# EAGLE board VOID01_REVA (EAGLE 7.7.0), part 1 of 2
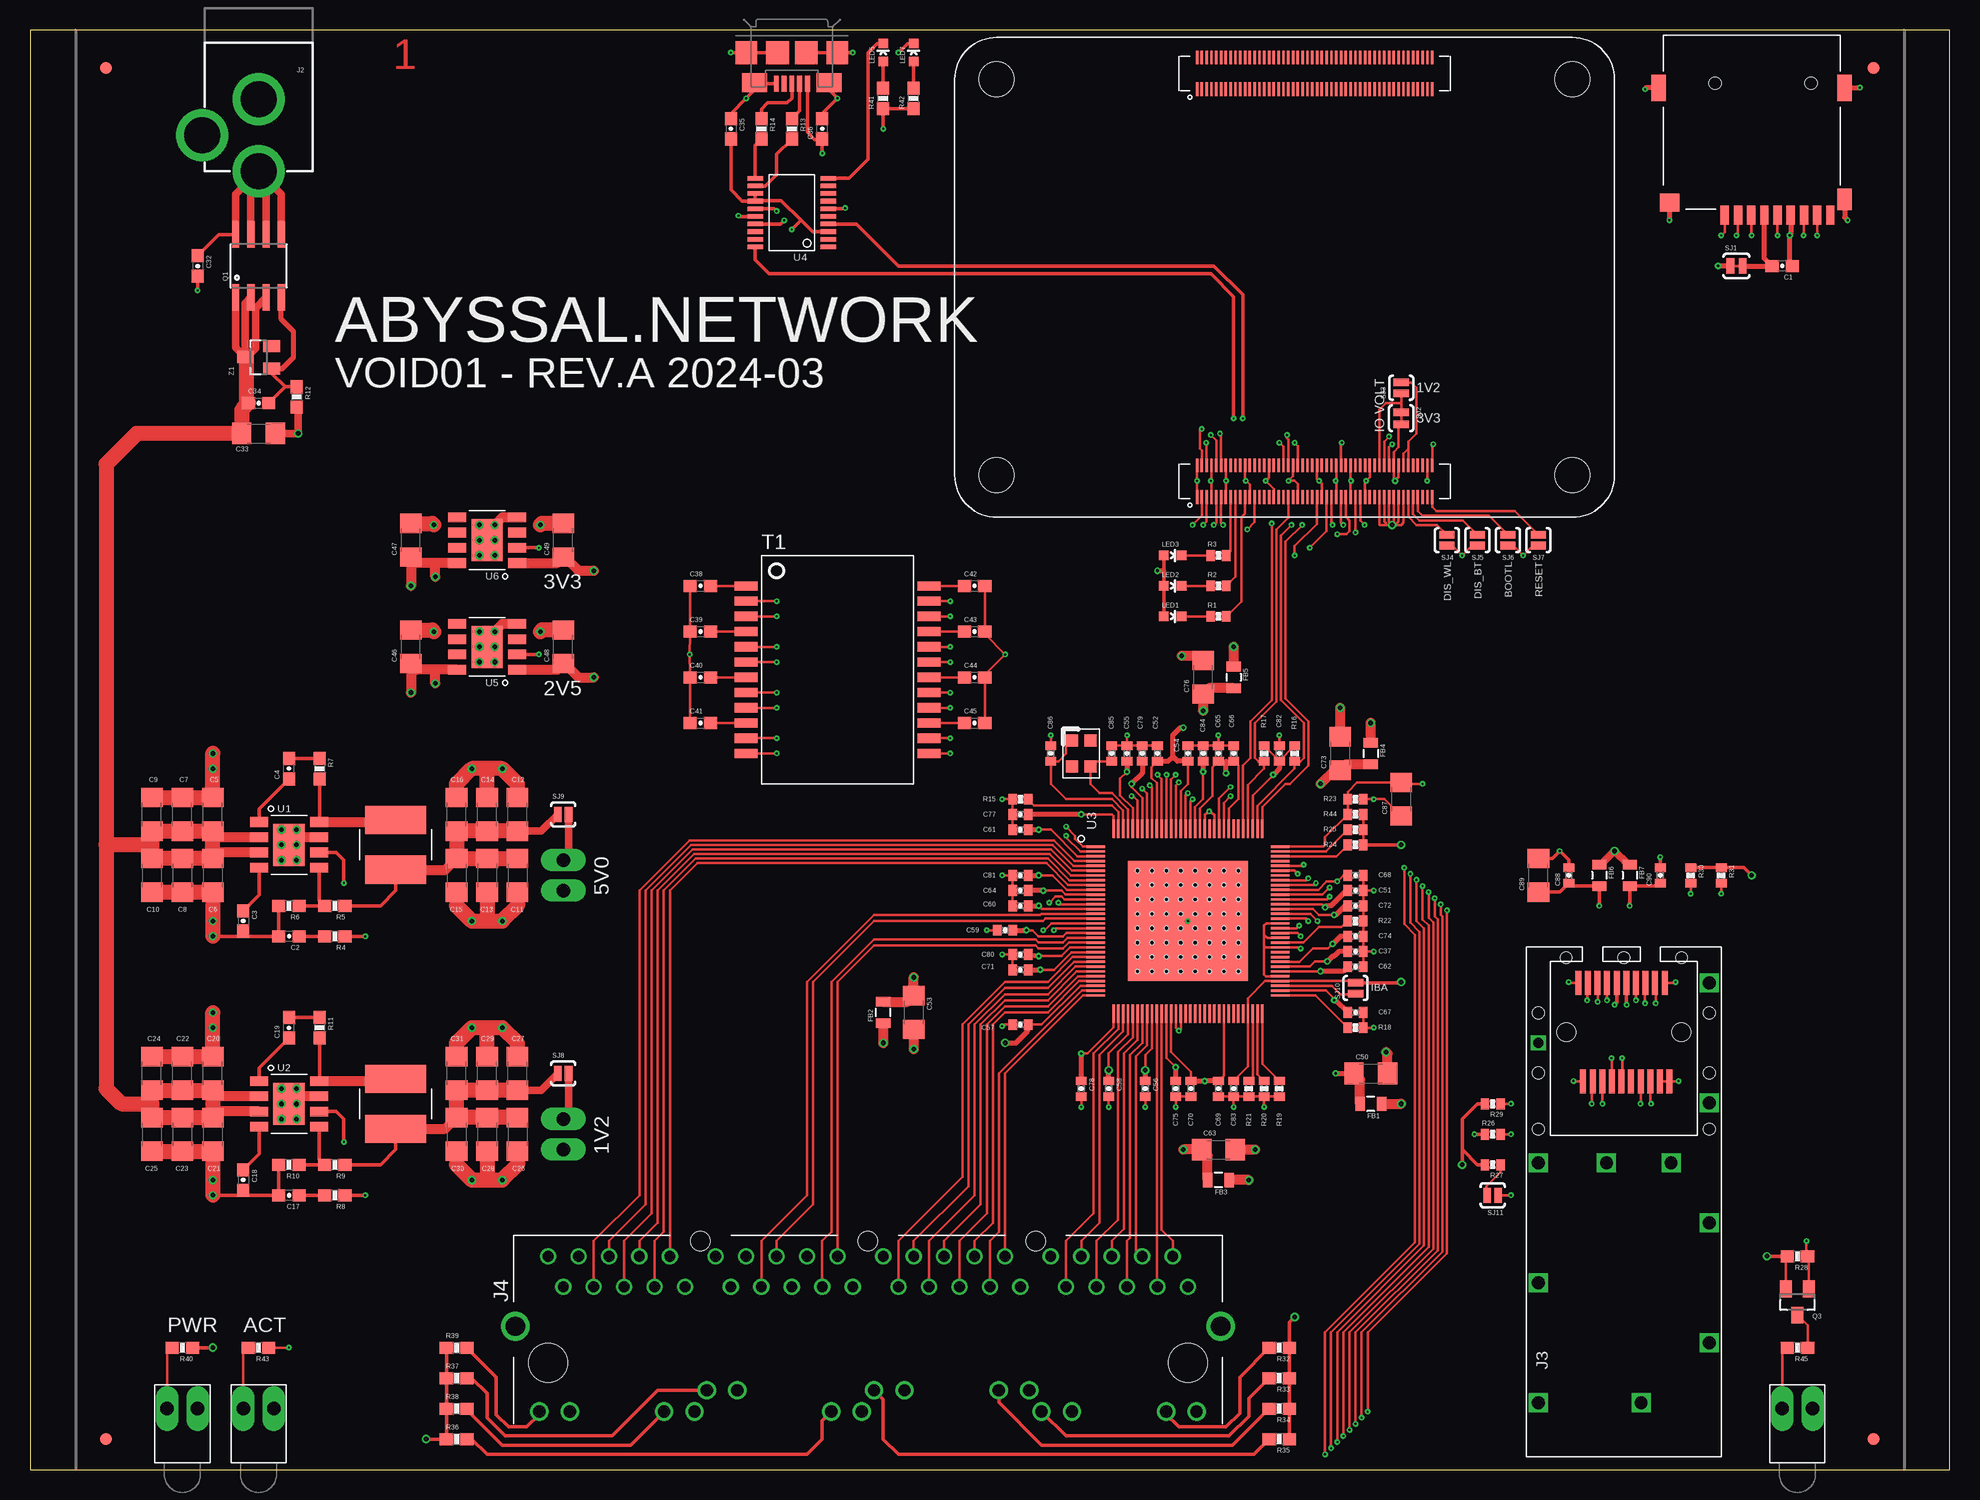
[diagram p6: board, top side]
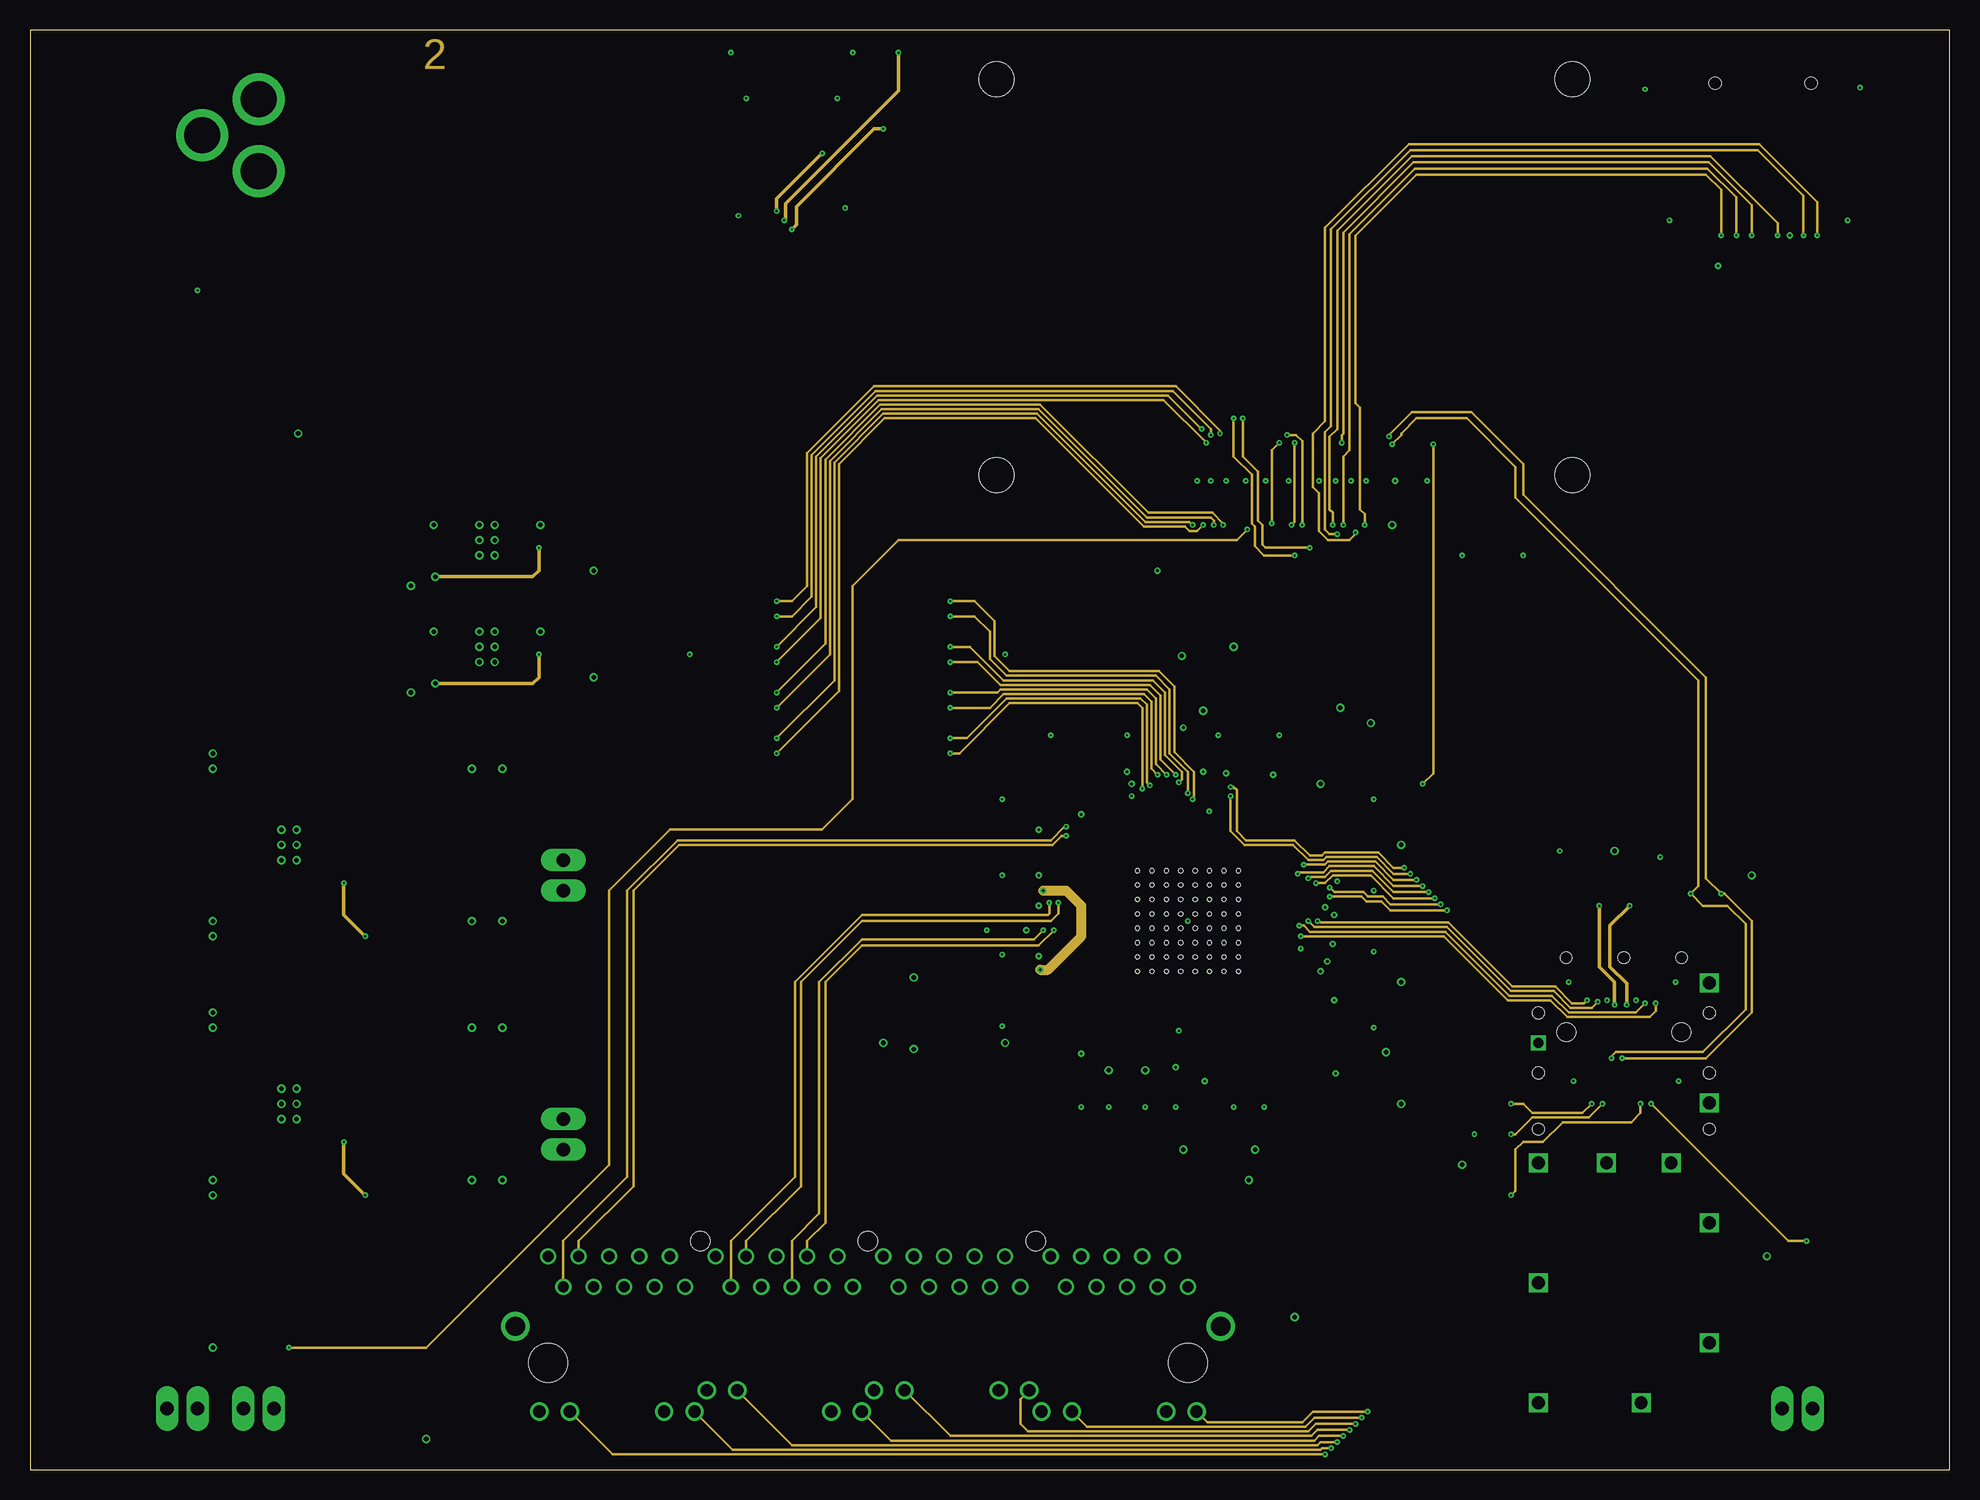
[diagram p7: board, inner layer Route2]
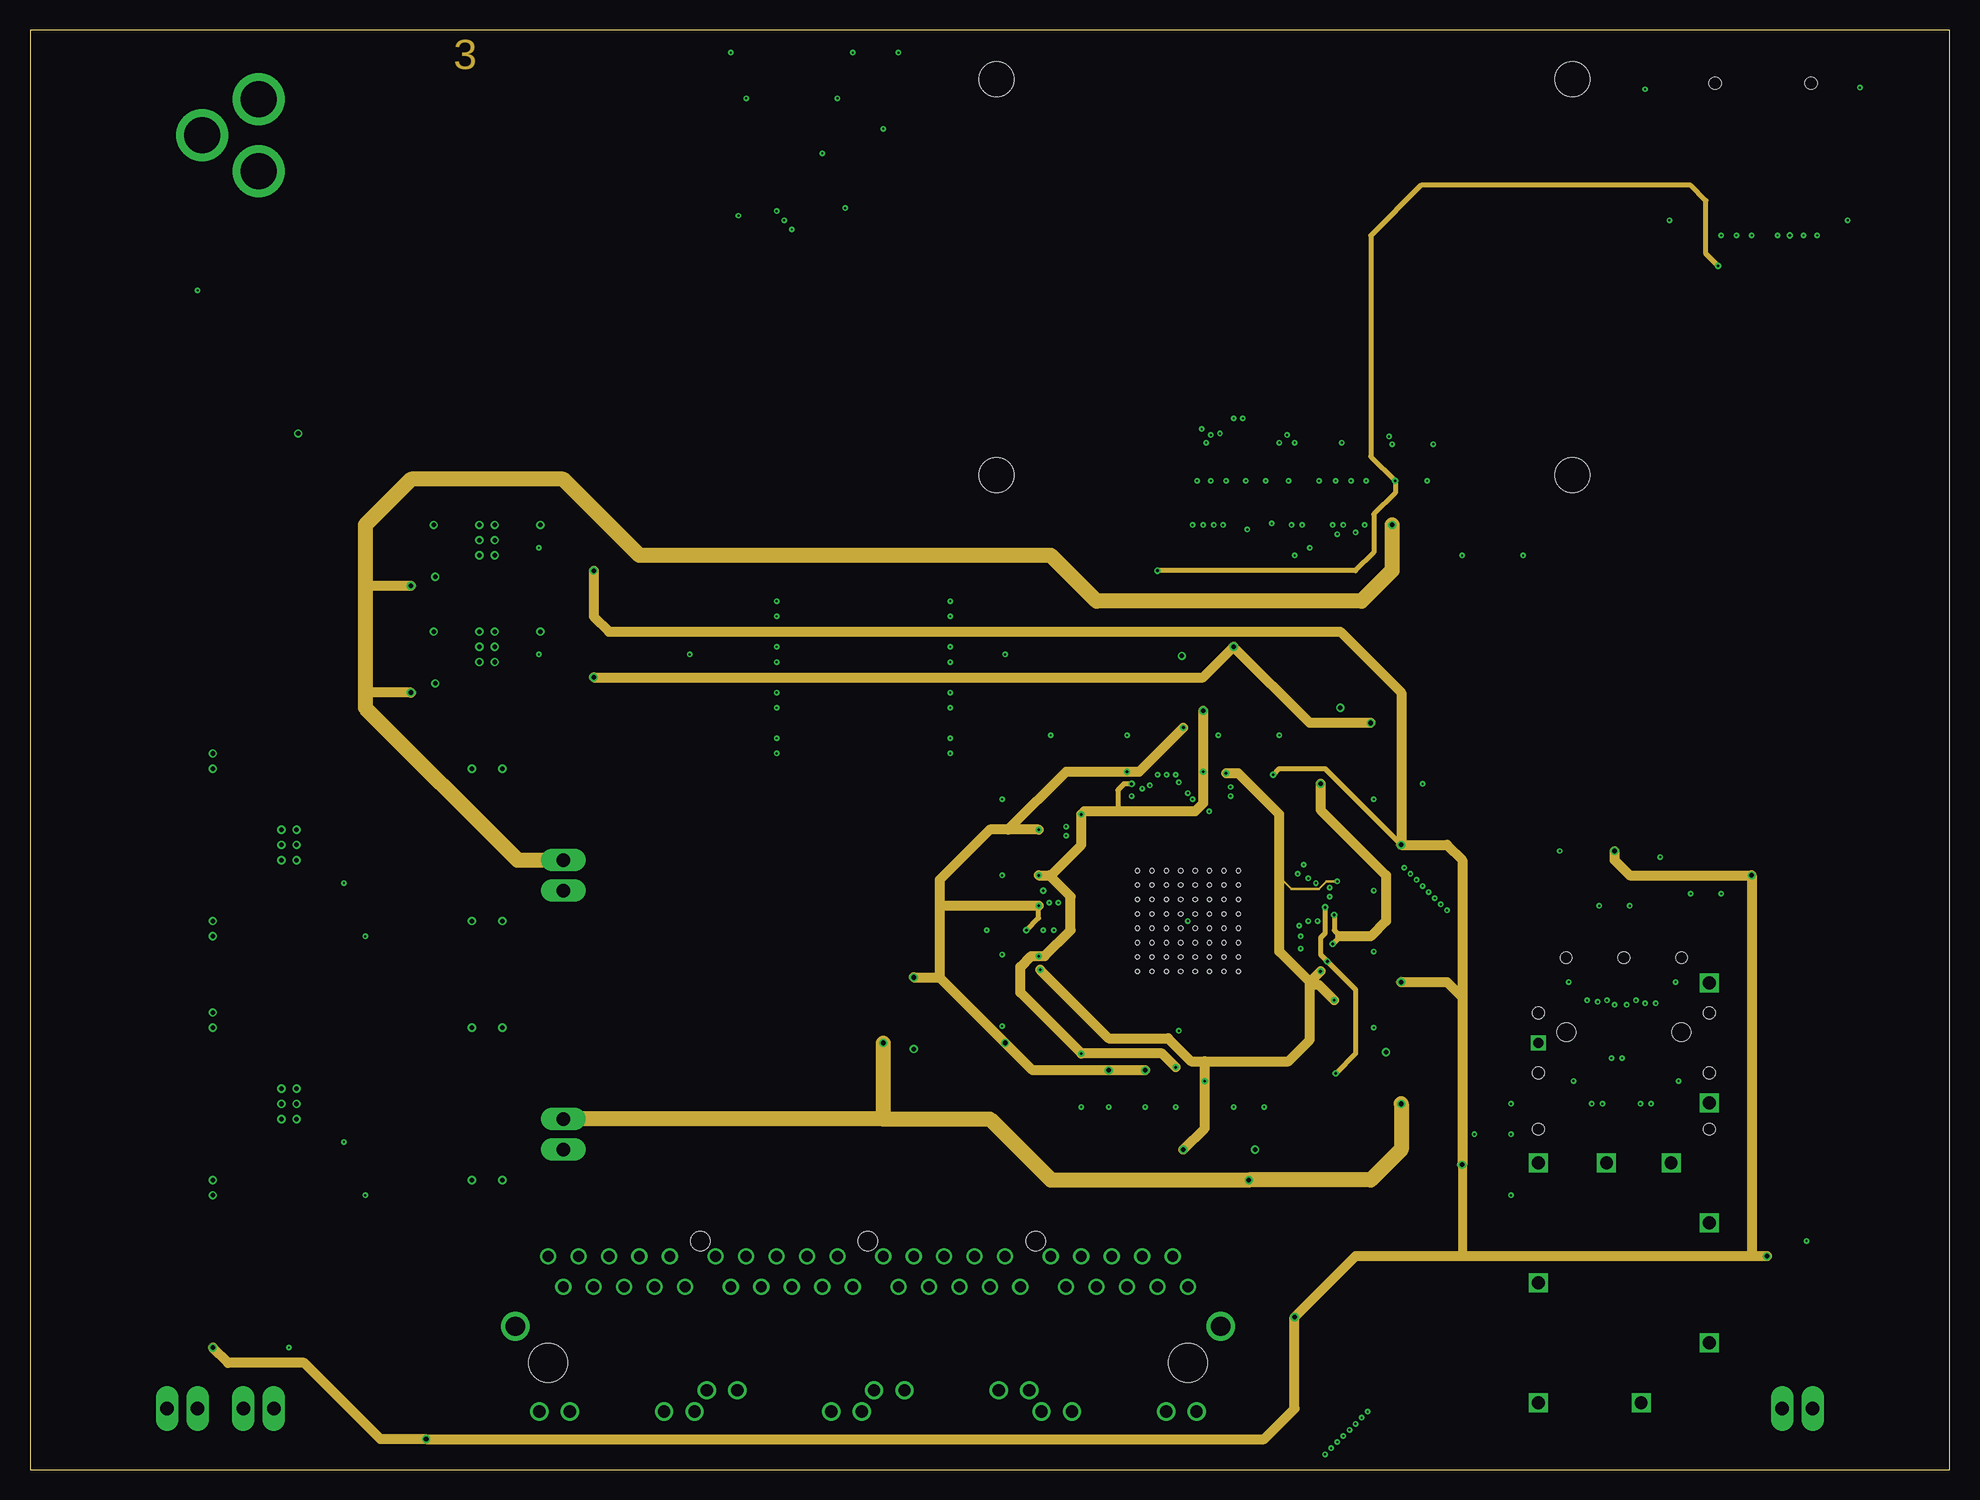
[diagram p8: board, inner layer Route15]
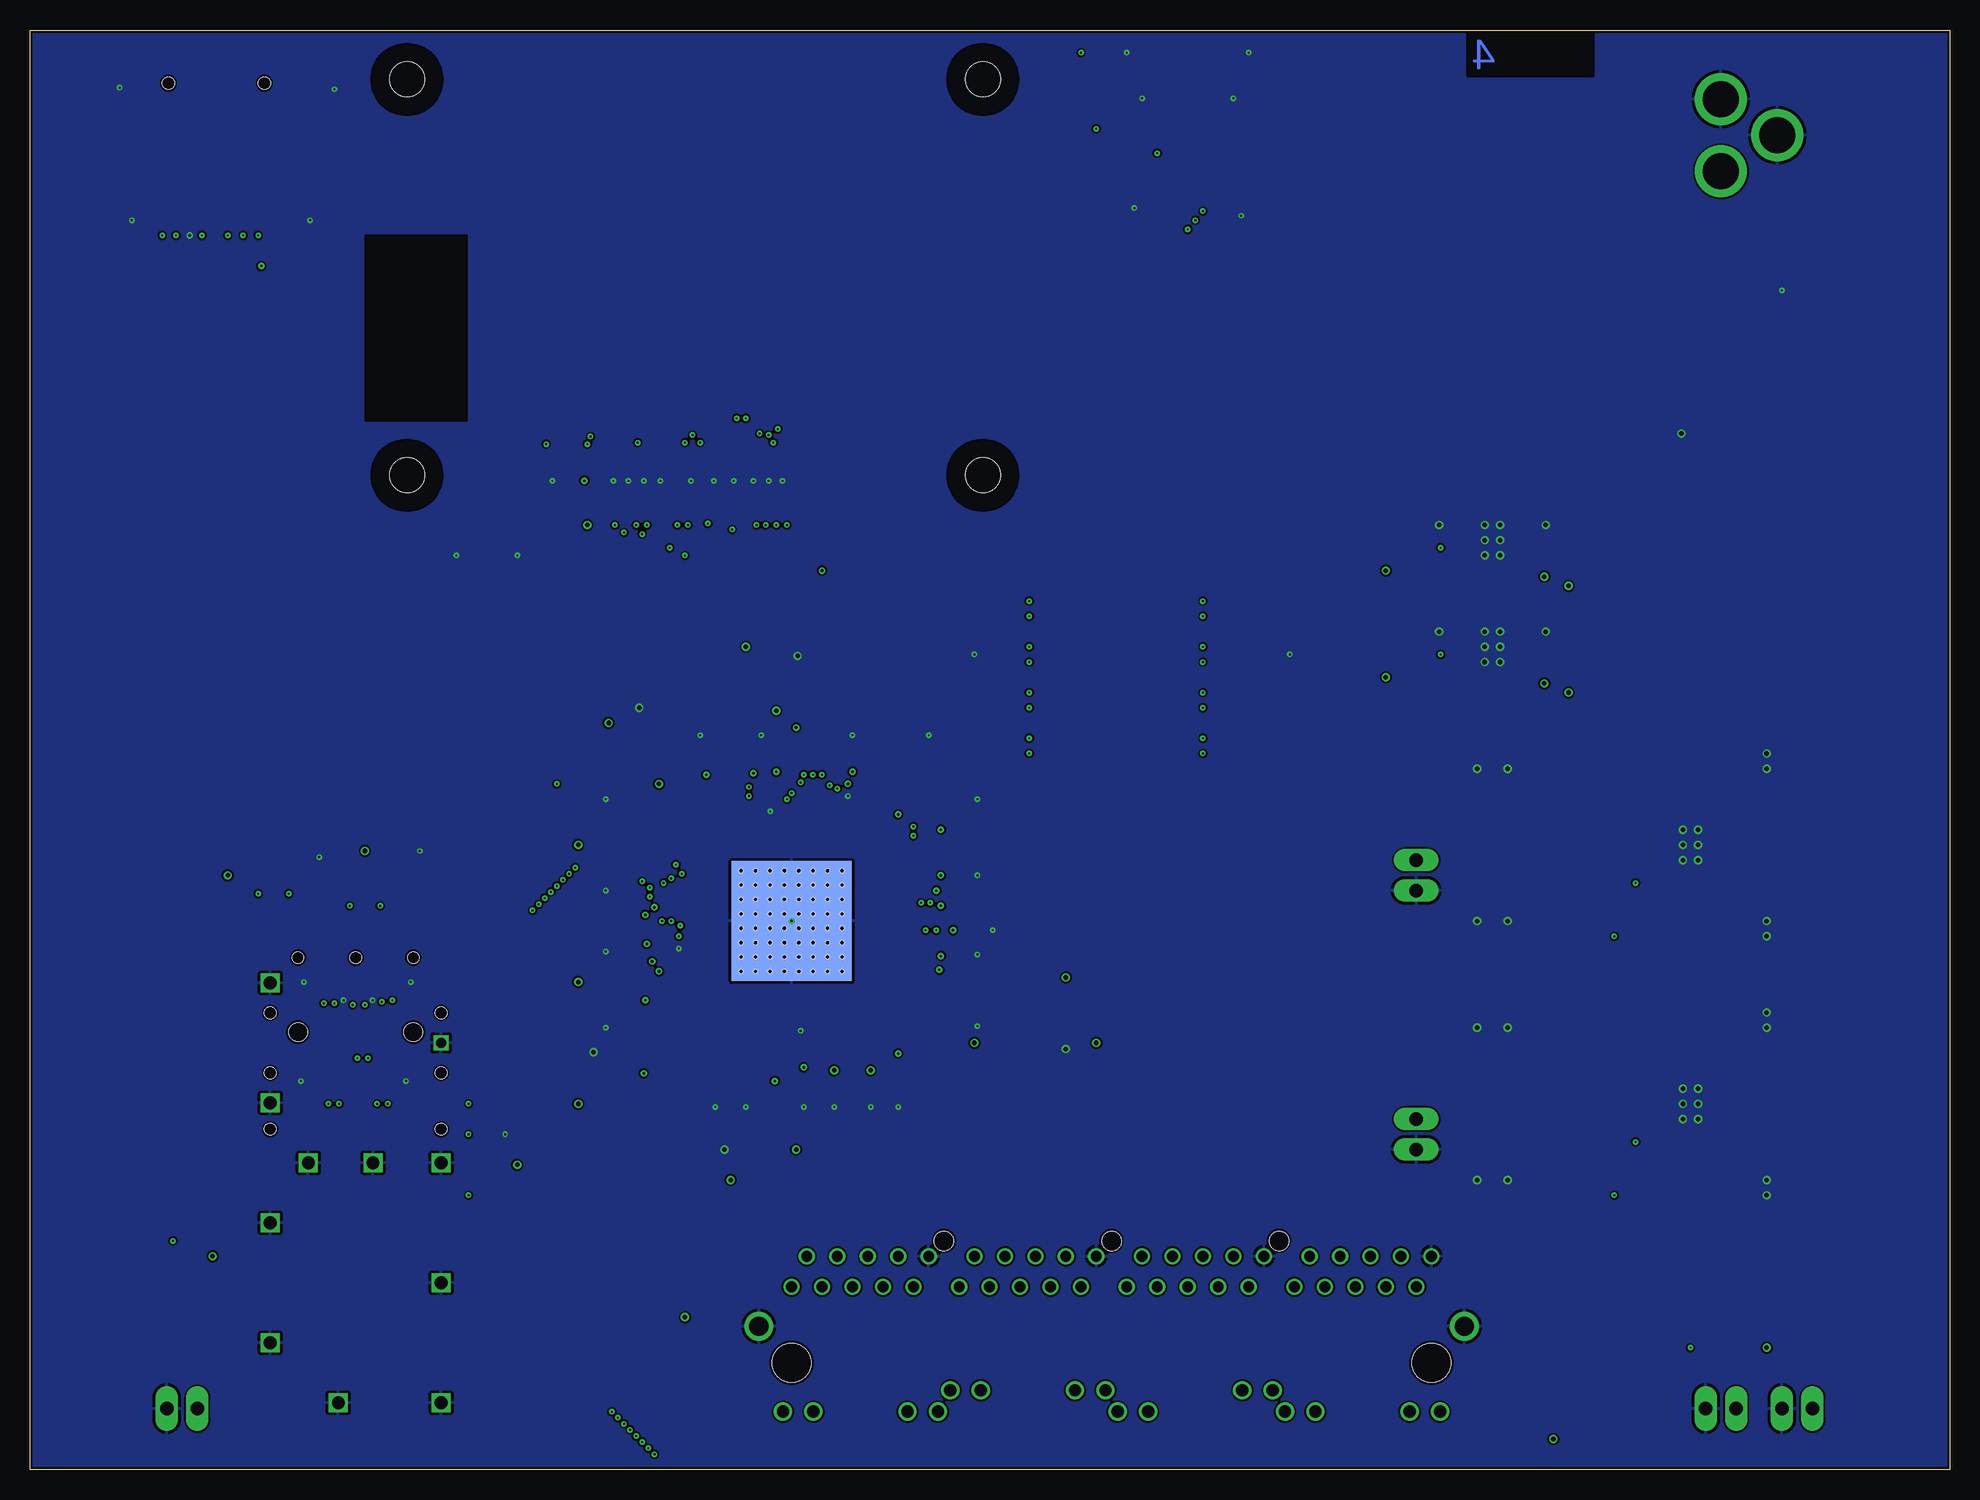
[diagram p9: board, bottom side, seen from below]

Size 160 x 120 mm. Coordinates in mm from the lower left corner, seen from the top.
Outline: 0,0 160,0 160,120 0,120 0,0
Copper layers (1*2*15*16): Top 0.0356mm / dielectric 1.5011mm / Route2 0.0356mm / dielectric 0.1499mm / Route15 0.0356mm / dielectric 0.2007mm / Bottom 0.0356mm
Design rules "JLCPCB *": minimum track width 5mil, minimum drill 6mil, track to track 6mil, track to pad 6mil, pad to pad 6mil, via to via 6mil, smd to smd 6mil, copper to edge 8mil, drill to drill 6mil, minimum pad ring 7mil, minimum via ring 6mil, stop-mask expansion 3mil, vias tented up to drill 12mil, thermal gap 10mil
tRestrict: 4 lines
bRestrict: 4 lines

## Footprints (pad centres in the part's own frame; a part is rotated, then mirrored left to right if it is on the bottom)
0603-CAP = smd 1.1 x 1: 1 -0.85,0; 2 0.85,0
1206 = smd 1.6 x 1.8: 1 -1.4,0; 2 1.4,0
0402-CAP = smd 0.7 x 0.9: 1 -0.65,0; 2 0.65,0
0805 = smd 0.8 x 1.2: 1 -0.9,0; 2 0.9,0
FIDUCIAL = smd 1 x 1: 1 0,0
MSD-4-A = smd 1.6 x 1.5: BODY@1 6.85,9.95 | smd 1.2 x 2.2: BODY@2 7.75,0.4; BODY@3 -7.75,0.4 | smd 1.2 x 1.8: BODY@4 -7.75,9.7 | smd 0.7 x 1.6: CD -6.55,11; P$1 2.25,11; P$2 1.15,11; P$3 0.05,11; P$4 -1.05,11; P$5 -2.15,11; P$6 -3.25,11; P$7 -4.35,11; P$8 -5.45,11 | hole 1: -4.95,0; 3.05,0
POWER_JACK_PTH = drill 2.997 pad 4.318: GND 0,7.7; GNDBREAK 4.7,10.7; PWR 0,13.7
SFP_SOCKET_CAGE = smd 2 x 0.5: 1 -3.2,-3.725; 2 -3.2,-4.525; 3 -3.2,-5.325; 4 -3.2,-6.125; 5 -3.2,-6.925; 6 -3.2,-7.725; 7 -3.2,-8.525; 8 -3.2,-9.325; 9 -3.2,-10.125; 10 -3.2,-10.925; 11 5,-10.525; 12 5,-9.725; 13 5,-8.925; 14 5,-8.125; 15 5,-7.325; 16 5,-6.525; 17 5,-5.725; 18 5,-4.925; 19 5,-4.125; 20 5,-3.325 | drill 0.85 square: CGND@1 0,0 | drill 1.05 square: CGND@6 5,-14.25; CGND@9 -5,-14.25; CGND@11 -15,-14.25; CGND@12 -25,-14.25; CGND@13 -30,-8.575; CGND@14 -30,0; CGND@15 -20,0; CGND@16 -10,0; CGND@19 -10,-5.675; CGND@20 -10,-11.075 | hole 1.55: 0.9,-2.325; 0.9,-11.925 | hole 0.95: 7.1,-2.325; 7.1,-7.125; 7.1,-11.925; 2.5,-14.25; -2.5,-14.25; -7.2,-14.25; -7.2,0; -2.5,0; 2.5,0
JXD0-4015NL = drill 0.9: P1_1 -26.67,8.89; P1_2 -25.4,6.35; P1_3 -24.13,8.89; P1_4 -22.86,6.35; P1_5 -21.59,8.89; P1_6 -20.32,6.35; P1_7 -19.05,8.89; P1_8 -17.78,6.35; P1_9 -16.51,8.89; P1_10 -15.24,6.35; P2_1 -12.7,8.89; P2_2 -11.43,6.35; P2_3 -10.16,8.89; P2_4 -8.89,6.35; P2_5 -7.62,8.89; P2_6 -6.35,6.35; P2_7 -5.08,8.89; P2_8 -3.81,6.35; P2_9 -2.54,8.89; P2_10 -1.27,6.35; P3_1 1.27,8.89; P3_2 2.54,6.35; P3_3 3.81,8.89; P3_4 5.08,6.35; P3_5 6.35,8.89; P3_6 7.62,6.35; P3_7 8.89,8.89; P3_8 10.16,6.35; P3_9 11.43,8.89; P3_10 12.7,6.35; P4_1 15.24,8.89; P4_2 16.51,6.35; P4_3 17.78,8.89; P4_4 19.05,6.35; P4_5 20.32,8.89; P4_6 21.59,6.35; P4_7 22.86,8.89; P4_8 24.13,6.35; P4_9 25.4,8.89; P4_10 26.67,6.35 | drill 1.02: P1_GRN_A -27.39,-4.06; P1_GRN_C -24.85,-4.06; P1_YLW_A -17,-4.06; P1_YLW_C -14.46,-4.06; P2_GRN_A -13.44,-2.28; P2_GRN_C -10.9,-2.28; P2_YLW_A -3.05,-4.06; P2_YLW_C -0.51,-4.06; P3_GRN_A 0.51,-2.28; P3_GRN_C 3.05,-2.28; P3_YLW_A 10.9,-2.28; P3_YLW_C 13.44,-2.28; P4_GRN_A 14.46,-4.06; P4_GRN_C 17,-4.06; P4_YLW_A 24.85,-4.06; P4_YLW_C 27.39,-4.06 | drill 1.6: SHIELD$1 -29.4,3.05; SHIELD$5 29.4,3.05 | hole 3.25: -26.67,0; 26.67,0 | hole 1.6: 0,10.16; -13.97,10.16; 13.97,10.16
1X02_LONGPADS = drill 1.118 pad 1.88 long: 1 0,0; 2 2.54,0
SRN6045TA = smd 5.105 x 2.349: P$1 0,2.076; P$2 0,-2.076
LED-0603 = smd 0.8 x 0.8: A 0,-0.75; C 0,0.75
LED_QBL7XX80D-MP4A = drill 1.118 pad 1.88 long: A -1.27,0; C 1.27,0
SO08 = smd 0.61 x 2.21: 1 -1.905,-2.616; 2 -0.635,-2.616; 3 0.635,-2.616; 4 1.905,-2.616; 5 1.905,2.616; 6 0.635,2.616; 7 -0.635,2.616; 8 -1.905,2.616
CRYSTAL_3.2X2.5 = smd 1.016 x 1.016: P$1 -1.079,-0.775; P$2 1.079,-0.775; P$3 1.079,0.775; P$4 -1.079,0.775
SOT-23 = smd 1 x 1.4: 1 -0.95,-1.1; 2 0.95,-1.1; 3 0,1.1
0402-RES = smd 0.7 x 0.9: 1 -0.65,0; 2 0.65,0
0603-RES = smd 1.1 x 1: 1 -0.85,0; 2 0.85,0
SJ_2S-TRACE = smd 0.635 x 1.27: 1 -0.508,0; 2 0.508,0
SJ_2S-NO = smd 0.635 x 1.27: 1 -0.45,0; 2 0.45,0
HX6098NL = smd 0.762 x 1.905: P$1 -6.35,-7.62; P$2 -5.08,-7.62; P$3 -3.81,-7.62; P$4 -2.54,-7.62; P$5 -1.27,-7.62; P$6 0,-7.62; P$7 1.27,-7.62; P$8 2.54,-7.62; P$9 3.81,-7.62; P$10 5.08,-7.62; P$11 6.35,-7.62; P$12 7.62,-7.62; P$13 7.62,7.62; P$14 6.35,7.62; P$15 5.08,7.62; P$16 3.81,7.62; P$17 2.54,7.62; P$18 1.27,7.62; P$19 0,7.62; P$20 -1.27,7.62; P$21 -2.54,7.62; P$22 -3.81,7.62; P$23 -5.08,7.62; P$24 -6.35,7.62
SO-8EP = smd 3.502 x 2.613: EP 0,0 | smd 0.802 x 1.505: P$1 1.905,2.498; P$2 0.635,2.498; P$3 -0.635,2.498; P$4 -1.905,2.498; P$5 -1.905,-2.498; P$6 -0.635,-2.498; P$7 0.635,-2.498; P$8 1.905,-2.498
TQFP-128-EP = smd 10 x 10: EP 0,0 | smd 10 x 10 bottom: EP1 0,0 | smd 0.2 x 1.54: P$1 -6.2,-7.7; P$2 -5.8,-7.7; P$3 -5.4,-7.7; P$4 -5,-7.7; P$5 -4.6,-7.7; P$6 -4.2,-7.7; P$7 -3.8,-7.7; P$8 -3.4,-7.7; P$9 -3,-7.7; P$10 -2.6,-7.7; P$11 -2.2,-7.7; P$12 -1.8,-7.7; P$13 -1.4,-7.7; P$14 -1,-7.7; P$15 -0.6,-7.7; P$16 -0.2,-7.7; P$17 0.2,-7.7; P$18 0.6,-7.7; P$19 1,-7.7; P$20 1.4,-7.7; P$21 1.8,-7.7; P$22 2.2,-7.7; P$23 2.6,-7.7; P$24 3,-7.7; P$25 3.4,-7.7; P$26 3.8,-7.7; P$27 4.2,-7.7; P$28 4.6,-7.7; P$29 5,-7.7; P$30 5.4,-7.7; P$31 5.8,-7.7; P$32 6.2,-7.7; P$65 6.2,7.7; P$66 5.8,7.7; P$67 5.4,7.7; P$68 5,7.7; P$69 4.6,7.7; P$70 4.2,7.7; P$71 3.8,7.7; P$72 3.4,7.7; P$73 3,7.7; P$74 2.6,7.7; P$75 2.2,7.7; P$76 1.8,7.7; P$77 1.4,7.7; P$78 1,7.7; P$79 0.6,7.7; P$80 0.2,7.7; P$81 -0.2,7.7; P$82 -0.6,7.7; P$83 -1,7.7; P$84 -1.4,7.7; P$85 -1.8,7.7; P$86 -2.2,7.7; P$87 -2.6,7.7; P$88 -3,7.7; P$89 -3.4,7.7; P$90 -3.8,7.7; P$91 -4.2,7.7; P$92 -4.6,7.7; P$93 -5,7.7; P$94 -5.4,7.7; P$95 -5.8,7.7; P$96 -6.2,7.7 | smd 1.54 x 0.2: P$33 7.7,-6.2; P$34 7.7,-5.8; P$35 7.7,-5.4; P$36 7.7,-5; P$37 7.7,-4.6; P$38 7.7,-4.2; P$39 7.7,-3.8; P$40 7.7,-3.4; P$41 7.7,-3; P$42 7.7,-2.6; P$43 7.7,-2.2; P$44 7.7,-1.8; P$45 7.7,-1.4; P$46 7.7,-1; P$47 7.7,-0.6; P$48 7.7,-0.2; P$49 7.7,0.2; P$50 7.7,0.6; P$51 7.7,1; P$52 7.7,1.4; P$53 7.7,1.8; P$54 7.7,2.2; P$55 7.7,2.6; P$56 7.7,3; P$57 7.7,3.4; P$58 7.7,3.8; P$59 7.7,4.2; P$60 7.7,4.6; P$61 7.7,5; P$62 7.7,5.4; P$63 7.7,5.8; P$64 7.7,6.2; P$97 -7.7,6.2; P$98 -7.7,5.8; P$99 -7.7,5.4; P$100 -7.7,5; P$101 -7.7,4.6; P$102 -7.7,4.2; P$103 -7.7,3.8; P$104 -7.7,3.4; P$105 -7.7,3; P$106 -7.7,2.6; P$107 -7.7,2.2; P$108 -7.7,1.8; P$109 -7.7,1.4; P$110 -7.7,1; P$111 -7.7,0.6; P$112 -7.7,0.2; P$113 -7.7,-0.2; P$114 -7.7,-0.6; P$115 -7.7,-1; P$116 -7.7,-1.4; P$117 -7.7,-1.8; P$118 -7.7,-2.2; P$119 -7.7,-2.6; P$120 -7.7,-3; P$121 -7.7,-3.4; P$122 -7.7,-3.8; P$123 -7.7,-4.2; P$124 -7.7,-4.6; P$125 -7.7,-5; P$126 -7.7,-5.4; P$127 -7.7,-5.8; P$128 -7.7,-6.2 | hole 0.33: 0.6,0.6; 0.6,-0.6; -0.6,-0.6; -0.6,0.6; -1.8,0.6; -1.8,-0.6; -3,-0.6; -4.2,-0.6; -3,0.6; -4.2,0.6; 1.8,0.6; 3,0.6; 4.2,0.6; 1.8,-0.6; 3,-0.6; 4.2,-0.6; -4.2,-1.8; -4.2,-3; -3,-1.8; -1.8,-1.8; -0.6,-1.8; 0.6,-1.8; 1.8,-1.8; 3,-1.8; 4.2,-1.8; -3,-3; -1.8,-3; -0.6,-3; 0.6,-3; 1.8,-3; 3,-3; 4.2,-3; 4.2,1.8; 3,1.8; 1.8,1.8; 0.6,1.8; -0.6,1.8; -1.8,1.8; -3,1.8; -4.2,1.8; -4.2,3; -3,3; -1.8,3; -0.6,3; 0.6,3; 1.8,3; 3,3; 4.2,3; -4.2,4.2; -3,4.2; -1.8,4.2; -0.6,4.2; 0.6,4.2; 1.8,4.2; 3,4.2; 4.2,4.2; -4.2,-4.2; -3,-4.2; -1.8,-4.2; -0.6,-4.2; 0.6,-4.2; 1.8,-4.2; 3,-4.2; 4.2,-4.2
SSOP-20 = smd 0.381 x 1.27: 1 -2.223,-3.048; 2 -1.587,-3.048; 3 -0.953,-3.048; 4 -0.318,-3.048; 5 0.318,-3.048; 6 0.953,-3.048; 7 1.587,-3.048; 8 2.223,-3.048; 9 2.857,-3.048; 10 3.493,-3.048; 11 3.493,3.048; 12 2.857,3.048; 13 2.223,3.048; 14 1.587,3.048; 15 0.953,3.048; 16 0.318,3.048; 17 -0.318,3.048; 18 -0.953,3.048; 19 -1.587,3.048; 20 -2.223,3.048
RPI-CM4 = smd 0.2 x 1.14: P$1 34.8,38.32; P$2 34.8,35.68; P$3 34.4,38.32; P$4 34.4,35.68; P$5 34,38.32; P$6 34,35.68; P$7 33.6,38.32; P$8 33.6,35.68; P$9 33.2,38.32; P$10 33.2,35.68; P$11 32.8,38.32; P$12 32.8,35.68; P$13 32.4,38.32; P$14 32.4,35.68; P$15 32,38.32; P$16 32,35.68; P$17 31.6,38.32; P$18 31.6,35.68; P$19 31.2,38.32; P$20 31.2,35.68; P$21 30.8,38.32; P$22 30.8,35.68; P$23 30.4,38.32; P$24 30.4,35.68; P$25 30,38.32; P$26 30,35.68; P$27 29.6,38.32; P$28 29.6,35.68; P$29 29.2,38.32; P$30 29.2,35.68; P$31 28.8,38.32; P$32 28.8,35.68; P$33 28.4,38.32; P$34 28.4,35.68; P$35 28,38.32; P$36 28,35.68; P$37 27.6,38.32; P$38 27.6,35.68; P$39 27.2,38.32; P$40 27.2,35.68; P$41 26.8,38.32; P$42 26.8,35.68; P$43 26.4,38.32; P$44 26.4,35.68; P$45 26,38.32; P$46 26,35.68; P$47 25.6,38.32; P$48 25.6,35.68; P$49 25.2,38.32; P$50 25.2,35.68; P$51 24.8,38.32; P$52 24.8,35.68; P$53 24.4,38.32; P$54 24.4,35.68; P$55 24,38.32; P$56 24,35.68; P$57 23.6,38.32; P$58 23.6,35.68; P$59 23.2,38.32; P$60 23.2,35.68; P$61 22.8,38.32; P$62 22.8,35.68; P$63 22.4,38.32; P$64 22.4,35.68; P$65 22,38.32; P$66 22,35.68; P$67 21.6,38.32; P$68 21.6,35.68; P$69 21.2,38.32; P$70 21.2,35.68; P$71 20.8,38.32; P$72 20.8,35.68; P$73 20.4,38.32; P$74 20.4,35.68; P$75 20,38.32; P$76 20,35.68; P$77 19.6,38.32; P$78 19.6,35.68; P$79 19.2,38.32; P$80 19.2,35.68; P$81 18.8,38.32; P$82 18.8,35.68; P$83 18.4,38.32; P$84 18.4,35.68; P$85 18,38.32; P$86 18,35.68; P$87 17.6,38.32; P$88 17.6,35.68; P$89 17.2,38.32; P$90 17.2,35.68; P$91 16.8,38.32; P$92 16.8,35.68; P$93 16.4,38.32; P$94 16.4,35.68; P$95 16,38.32; P$96 16,35.68; P$97 15.6,38.32; P$98 15.6,35.68; P$99 15.2,38.32; P$100 15.2,35.68; P$101 34.8,4.32; P$102 34.8,1.68; P$103 34.4,4.32; P$104 34.4,1.68; P$105 34,4.32; P$106 34,1.68; P$107 33.6,4.32; P$108 33.6,1.68; P$109 33.2,4.32; P$110 33.2,1.68; P$111 32.8,4.32; P$112 32.8,1.68; P$113 32.4,4.32; P$114 32.4,1.68; P$115 32,4.32; P$116 32,1.68; P$117 31.6,4.32; P$118 31.6,1.68; P$119 31.2,4.32; P$120 31.2,1.68; P$121 30.8,4.32; P$122 30.8,1.68; P$123 30.4,4.32; P$124 30.4,1.68; P$125 30,4.32; P$126 30,1.68; P$127 29.6,4.32; P$128 29.6,1.68; P$129 29.2,4.32; P$130 29.2,1.68; P$131 28.8,4.32; P$132 28.8,1.68; P$133 28.4,4.32; P$134 28.4,1.68; P$135 28,4.32; P$136 28,1.68; P$137 27.6,4.32; P$138 27.6,1.68; P$139 27.2,4.32; P$140 27.2,1.68; P$141 26.8,4.32; P$142 26.8,1.68; P$143 26.4,4.32; P$144 26.4,1.68; P$145 26,4.32; P$146 26,1.68; P$147 25.6,4.32; P$148 25.6,1.68; P$149 25.2,4.32; P$150 25.2,1.68; P$151 24.8,4.32; P$152 24.8,1.68; P$153 24.4,4.32; P$154 24.4,1.68; P$155 24,4.32; P$156 24,1.68; P$157 23.6,4.32; P$158 23.6,1.68; P$159 23.2,4.32; P$160 23.2,1.68; P$161 22.8,4.32; P$162 22.8,1.68; P$163 22.4,4.32; P$164 22.4,1.68; P$165 22,4.32; P$166 22,1.68; P$167 21.6,4.32; P$168 21.6,1.68; P$169 21.2,4.32; P$170 21.2,1.68; P$171 20.8,4.32; P$172 20.8,1.68; P$173 20.4,4.32; P$174 20.4,1.68; P$175 20,4.32; P$176 20,1.68; P$177 19.6,4.32; P$178 19.6,1.68; P$179 19.2,4.32; P$180 19.2,1.68; P$181 18.8,4.32; P$182 18.8,1.68; P$183 18.4,4.32; P$184 18.4,1.68; P$185 18,4.32; P$186 18,1.68; P$187 17.6,4.32; P$188 17.6,1.68; P$189 17.2,4.32; P$190 17.2,1.68; P$191 16.8,4.32; P$192 16.8,1.68; P$193 16.4,4.32; P$194 16.4,1.68; P$195 16,4.32; P$196 16,1.68; P$197 15.6,4.32; P$198 15.6,1.68; P$199 15.2,4.32; P$200 15.2,1.68 | hole 2.9: 3.5,3.5; 51.5,3.5; 51.5,36.5; 3.5,36.5
USB-MICROB-10118192 = smd 0.4 x 1.35: 1 -1.3,2.6; 2 -0.65,2.6; 3 0,2.6; 4 0.65,2.6; 5 1.3,2.6 | smd 1.8 x 1.9: BODY@1 -3.8,0; BODY@4 3.8,0 | smd 1.9 x 1.9: BODY@2 -1.2,0; BODY@3 1.2,0 | smd 2.1 x 1.6: BODY@5 -3.1,2.5; BODY@6 3.1,2.5

## Placement (x,y rotation side)
C1  0.1uF  [0603-CAP]  146.05,100.33 180 top
C2  2.7nF  [0603-CAP]  21.59,44.45 180 top
C3  0.1uF  [0603-CAP]  17.78,45.72 270 top
C4  0.1uF  [0603-CAP]  21.59,58.42 90 top
C5  10uF  [1206]  15.24,54.61 90 top
C6  10uF  [1206]  15.24,49.53 270 top
C7  10uF  [1206]  12.7,54.61 90 top
C8  10uF  [1206]  12.7,49.53 270 top
C9  10uF  [1206]  10.16,54.61 90 top
C10  10uF  [1206]  10.16,49.53 270 top
C11  10uF  [1206]  40.64,49.53 270 top
C12  10uF  [1206]  40.64,54.61 90 top
C13  10uF  [1206]  38.1,49.53 270 top
C14  10uF  [1206]  38.1,54.61 90 top
C15  10uF  [1206]  35.56,49.53 270 top
C16  10uF  [1206]  35.56,54.61 90 top
C17  2.7nF  [0603-CAP]  21.59,22.86 180 top
C18  0.1uF  [0603-CAP]  17.78,24.13 270 top
C19  0.1uF  [0603-CAP]  21.59,36.83 90 top
C20  10uF  [1206]  15.24,33.02 90 top
C21  10uF  [1206]  15.24,27.94 270 top
C22  10uF  [1206]  12.7,33.02 90 top
C23  10uF  [1206]  12.7,27.94 270 top
C24  10uF  [1206]  10.16,33.02 90 top
C25  10uF  [1206]  10.16,27.94 270 top
C26  10uF  [1206]  40.64,27.94 270 top
C27  10uF  [1206]  40.64,33.02 90 top
C28  10uF  [1206]  38.1,27.94 270 top
C29  10uF  [1206]  38.1,33.02 90 top
C30  10uF  [1206]  35.56,27.94 270 top
C31  10uF  [1206]  35.56,33.02 90 top
C32  0.1uF  [0603-CAP]  13.97,100.33 270 top
C33  10uF  [1206]  19.05,86.36 0 top
C34  0.1uF  [0603-CAP]  19.05,88.9 0 top
C35  0.1uF  [0603-CAP]  58.42,111.76 270 top
C36  0.1uF  [0603-CAP]  66.04,111.76 90 top
C37  0.1uF  [0402-CAP]  110.49,43.18 0 top
C38  0.1uF  [0603-CAP]  55.88,73.66 0 top
C39  0.1uF  [0603-CAP]  55.88,69.85 0 top
C40  0.1uF  [0603-CAP]  55.88,66.04 0 top
C41  0.1uF  [0603-CAP]  55.88,62.23 0 top
C42  0.1uF  [0603-CAP]  78.74,73.66 0 top
C43  0.1uF  [0603-CAP]  78.74,69.85 0 top
C44  0.1uF  [0603-CAP]  78.74,66.04 0 top
C45  0.1uF  [0603-CAP]  78.74,62.23 0 top
C46  10uF  [1206]  31.75,68.58 90 top
C47  10uF  [1206]  31.75,77.47 90 top
C48  10uF  [1206]  44.45,68.58 90 top
C49  10uF  [1206]  44.45,77.47 90 top
C50  10uF  [1206]  111.76,33.02 0 top
C51  0.1uF  [0402-CAP]  110.49,48.26 0 top
C52  0.1uF  [0402-CAP]  93.98,59.69 90 top
C53  10uF  [1206]  73.66,38.1 270 top
C54  0.1uF  [0402-CAP]  96.52,59.69 90 top
C55  0.1uF  [0402-CAP]  91.44,59.69 90 top
C56  0.1uF  [0402-CAP]  92.96,31.75 270 top
C57  0.1uF  [0402-CAP]  82.55,37.08 180 top
C58  0.1uF  [0402-CAP]  89.92,31.75 270 top
C59  0.1uF  [0402-CAP]  81.28,44.96 180 top
C60  0.1uF  [0402-CAP]  82.55,46.99 180 top
C61  0.1uF  [0402-CAP]  82.55,53.34 180 top
C62  0.1uF  [0402-CAP]  110.49,41.91 0 top
C63  10uF  [1206]  99.06,26.67 0 top
C64  0.1uF  [0402-CAP]  82.55,48.26 180 top
C65  0.1uF  [0402-CAP]  99.06,59.69 90 top
C66  0.1uF  [0402-CAP]  100.33,59.69 90 top
C67  0.1uF  [0402-CAP]  110.49,38.1 0 top
C68  0.1uF  [0402-CAP]  110.49,49.53 0 top
C69  0.1uF  [0402-CAP]  99.06,31.75 270 top
C70  0.1uF  [0402-CAP]  96.77,31.75 270 top
C71  0.1uF  [0402-CAP]  82.55,41.66 180 top
C72  0.1uF  [0402-CAP]  110.49,46.99 0 top
C73  10uF  [1206]  109.22,59.69 90 top
C74  0.1uF  [0402-CAP]  110.49,44.45 0 top
C75  0.1uF  [0402-CAP]  95.5,31.75 270 top
C76  10uF  [1206]  97.79,66.04 90 top
C77  0.1uF  [0402-CAP]  82.55,54.61 180 top
C78  0.1uF  [0402-CAP]  87.63,31.75 270 top
C79  0.1uF  [0402-CAP]  92.71,59.69 90 top
C80  0.1uF  [0402-CAP]  82.55,42.93 180 top
C81  0.1uF  [0402-CAP]  82.55,49.53 180 top
C82  0.1uF  [0402-CAP]  104.14,59.69 90 top
C83  0.1uF  [0402-CAP]  100.33,31.75 270 top
C84  0.1uF  [0402-CAP]  97.79,59.69 90 top
C85  15pF  [0402-CAP]  90.17,59.69 90 top
C86  15pF  [0402-CAP]  85.09,59.69 270 top
C87  10uF  [1206]  114.3,55.88 90 top
C88  0.1uF  [0402-CAP]  128.27,49.53 90 top
C89  10uF  [1206]  125.73,49.53 90 top
C90  0.1uF  [0402-CAP]  135.89,49.53 90 top
FB1  [0805]  111.76,30.48 180 top
FB2  [0805]  71.12,38.1 90 top
FB3  [0805]  99.06,24.13 180 top
FB4  [0805]  111.76,59.69 270 top
FB5  [0805]  100.33,66.04 270 top
FB6  [0805]  130.81,49.53 270 top
FB7  [0805]  133.35,49.53 270 top
FID1  FIDUCIAL  [FIDUCIAL]  6.35,2.54 0 top
FID2  FIDUCIAL  [FIDUCIAL]  153.67,2.54 0 top
FID3  FIDUCIAL  [FIDUCIAL]  153.67,116.84 0 top
FID4  FIDUCIAL  [FIDUCIAL]  6.35,116.84 0 top
J1  MICROSD  [MSD-4-A]  143.51,115.57 180 top
J2  POWER_JACKPTH  [POWER_JACK_PTH]  19.05,121.92 180 top
J3  SFP  [SFP_SOCKET_CAGE]  125.73,35.56 90 top
J4  JXD0-4015NL  [JXD0-4015NL]  69.85,8.89 0 top
JP1  [1X02_LONGPADS]  44.45,50.8 270 top
JP2  [1X02_LONGPADS]  44.45,29.21 270 top
L1  3.3uH  [SRN6045TA]  30.48,52.07 0 top
L2  3.3uH  [SRN6045TA]  30.48,30.48 0 top
LED1  G  [LED-0603]  95.25,71.12 270 top
LED2  Y  [LED-0603]  95.25,73.66 270 top
LED3  G  [LED-0603]  95.25,76.2 270 top
LED4  LED  [LED_QBL7XX80D-MP4A]  12.7,5.08 0 top
LED5  G  [LED-0603]  71.12,118.11 0 top
LED6  LED  [LED_QBL7XX80D-MP4A]  147.32,5.08 0 top
LED7  G  [LED-0603]  73.66,118.11 0 top
LED8  LED  [LED_QBL7XX80D-MP4A]  19.05,5.08 0 top
Q1  MOSFET_P_CHANNELDMP4015SSS  [SO08]  19.05,100.33 0 top
Q2  [CRYSTAL_3.2X2.5]  87.63,59.69 270 top
Q3  MOSFET_P_CHANNELAO3423  [SOT-23]  147.32,13.97 180 top
R1  1K  [0402-RES]  99.06,71.12 0 top
R2  1K  [0402-RES]  99.06,73.66 0 top
R3  1K  [0402-RES]  99.06,76.2 0 top
R4  15.8K  [0603-RES]  25.4,44.45 180 top
R5  115.8K  [0603-RES]  25.4,46.99 180 top
R6  22.1K  [0603-RES]  21.59,46.99 180 top
R7  10R  [0603-RES]  24.13,58.42 270 top
R8  3.74K  [0603-RES]  25.4,22.86 180 top
R9  11K  [0603-RES]  25.4,25.4 180 top
R10  22.1K  [0603-RES]  21.59,25.4 180 top
R11  22R  [0603-RES]  24.13,36.83 270 top
R12  10K  [0603-RES]  22.23,89.41 270 top
R13  27  [0603-RES]  63.5,111.76 270 top
R14  27  [0603-RES]  60.96,111.76 270 top
R15  6.04K  [0402-RES]  82.55,55.88 180 top
R16  4.7K  [0402-RES]  105.41,59.69 90 top
R17  4.7K  [0402-RES]  102.87,59.69 90 top
R18  10K  [0402-RES]  110.49,36.83 0 top
R19  10K  [0402-RES]  104.14,31.75 270 top
R20  10K  [0402-RES]  102.87,31.75 270 top
R21  10K  [0402-RES]  101.6,31.75 270 top
R22  191R  [0402-RES]  110.49,45.72 0 top
R23  DNP  [0402-RES]  110.49,55.88 0 top
R24  10K  [0402-RES]  110.49,52.07 0 top
R25  10K  [0402-RES]  110.49,53.34 0 top
R26  1K  [0402-RES]  121.92,27.94 0 top
R27  1K  [0402-RES]  121.92,25.4 180 top
R28  10K  [0603-RES]  147.32,17.78 180 top
R29  10K  [0402-RES]  121.92,30.48 180 top
R30  4.7K  [0402-RES]  138.43,49.53 270 top
R31  4.7K  [0402-RES]  140.97,49.53 270 top
R32  1K  [0603-RES]  104.14,10.16 180 top
R33  1K  [0603-RES]  104.14,7.62 180 top
R34  1K  [0603-RES]  104.14,5.08 180 top
R35  1K  [0603-RES]  104.14,2.54 180 top
R36  1K  [0603-RES]  35.56,2.54 0 top
R37  1K  [0603-RES]  35.56,7.62 0 top
R38  1K  [0603-RES]  35.56,5.08 0 top
R39  1K  [0603-RES]  35.56,10.16 0 top
R40  1K  [0603-RES]  12.7,10.16 180 top
R41  1K  [0603-RES]  71.12,114.3 90 top
R42  1K  [0603-RES]  73.66,114.3 90 top
R43  1K  [0603-RES]  19.05,10.16 180 top
R44  10K  [0402-RES]  110.49,54.61 0 top
R45  1K  [0603-RES]  147.32,10.16 180 top
SJ1  [SJ_2S-TRACE]  142.24,100.33 0 top
SJ2  NC  [SJ_2S-TRACE]  114.3,87.63 270 top
SJ3  NO  [SJ_2S-NO]  114.3,90.17 90 top
SJ4  NO  [SJ_2S-NO]  118.11,77.47 90 top
SJ5  NO  [SJ_2S-NO]  120.65,77.47 90 top
SJ6  NO  [SJ_2S-NO]  123.19,77.47 90 top
SJ7  NO  [SJ_2S-NO]  125.73,77.47 90 top
SJ8  NO  [SJ_2S-NO]  44.45,33.02 0 top
SJ9  NO  [SJ_2S-NO]  44.45,54.61 0 top
SJ10  NO  [SJ_2S-NO]  110.49,40.13 90 top
SJ11  [SJ_2S-NO]  121.92,22.86 180 top
T1  HX6098NL  [HX6098NL]  67.31,67.31 270 top
U1  AP64501  [SO-8EP]  21.59,52.07 90 top
U2  AP64501  [SO-8EP]  21.59,30.48 90 top
U3  KSZ9477S  [TQFP-128-EP]  96.52,45.72 270 top
U4  FT231XS  [SSOP-20]  63.5,104.14 90 top
U5  AP7361EA-25SP-13  [SO-8EP]  38.1,68.58 270 top
U6  AP7361EA-33SP-13  [SO-8EP]  38.1,77.47 270 top
U$1  RPI-CM4  [RPI-CM4]  132.08,119.38 180 top
U$2  USB-MICROB  [USB-MICROB-10118192]  63.5,118.11 180 top
Z1  12V  [SOT-23]  19.05,92.71 90 top